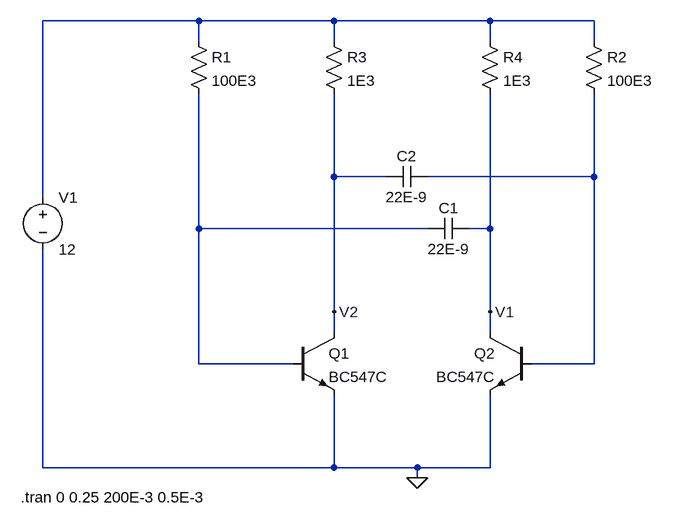
[diagram p0: schematic SimpleAstableMultivibrator.asc]
SimpleAstableMultivibrator.asc, the LTspice schematic file:
Version 4
SHEET 1 880 820
WIRE 32 64 -208 64
WIRE 240 64 32 64
WIRE 480 64 240 64
WIRE 640 64 480 64
WIRE 32 96 32 64
WIRE 240 96 240 64
WIRE 480 96 480 64
WIRE 640 96 640 64
WIRE 240 304 240 176
WIRE 320 304 240 304
WIRE 640 304 640 176
WIRE 640 304 384 304
WIRE -208 336 -208 64
WIRE 32 384 32 176
WIRE 384 384 32 384
WIRE 480 384 480 176
WIRE 480 384 448 384
WIRE 240 512 240 304
WIRE 480 512 480 384
WIRE 240 544 240 512
WIRE 480 544 480 512
WIRE 32 592 32 384
WIRE 176 592 32 592
WIRE 640 592 640 304
WIRE 640 592 544 592
WIRE -208 752 -208 416
WIRE 240 752 240 640
WIRE 240 752 -208 752
WIRE 368 752 240 752
WIRE 480 752 480 640
WIRE 480 752 368 752
WIRE 368 768 368 752
FLAG 368 768 0
FLAG 240 512 V2
FLAG 480 512 V1
SYMBOL res 16 80 R0
SYMATTR InstName R1
SYMATTR Value 100E3
SYMBOL res 224 80 R0
SYMATTR InstName R3
SYMATTR Value 1E3
SYMBOL res 624 80 R0
SYMATTR InstName R2
SYMATTR Value 100E3
SYMBOL res 464 80 R0
SYMATTR InstName R4
SYMATTR Value 1E3
SYMBOL cap 448 368 R90
WINDOW 0 0 32 VBottom 2
WINDOW 3 32 32 VTop 2
SYMATTR InstName C1
SYMATTR Value 22E-9
SYMBOL cap 384 288 R90
WINDOW 0 0 32 VBottom 2
WINDOW 3 32 32 VTop 2
SYMATTR InstName C2
SYMATTR Value 22E-9
SYMBOL npn 176 544 R0
SYMATTR InstName Q1
SYMATTR Value BC547C
SYMBOL npn 544 544 M0
SYMATTR InstName Q2
SYMATTR Value BC547C
SYMBOL voltage -208 320 R0
WINDOW 123 0 0 Left 0
WINDOW 39 0 0 Left 0
SYMATTR InstName V1
SYMATTR Value 12
TEXT -242 798 Left 2 !.tran 0 0.25 200E-3 0.5E-3

The netlist it stands for:
* SimpleAstableMultivibrator.asc
R1 N001 N003 100E3
R3 N001 V2 1E3
R2 N001 N002 100E3
R4 N001 V1 1E3
C1 V1 N003 22E-9
C2 N002 V2 22E-9
Q1 V2 N003 0 0 BC547C
Q2 V1 N002 0 0 BC547C
V1 N001 0 12
.model NPN NPN
.model PNP PNP
.lib standard.bjt
.tran 0 0.25 200E-3 0.5E-3
.backanno
.end